# Altium schematic sheet FPGA_165B_StopWatch.SchDoc
size B; Organization: Altium Limited; Address1: L3, 12a Rodborough Rd; Address2: Frenchs Forest; Address3: NSW; Address4: Australia 2086; DocumentNumber: 1; SheetNumber: 1
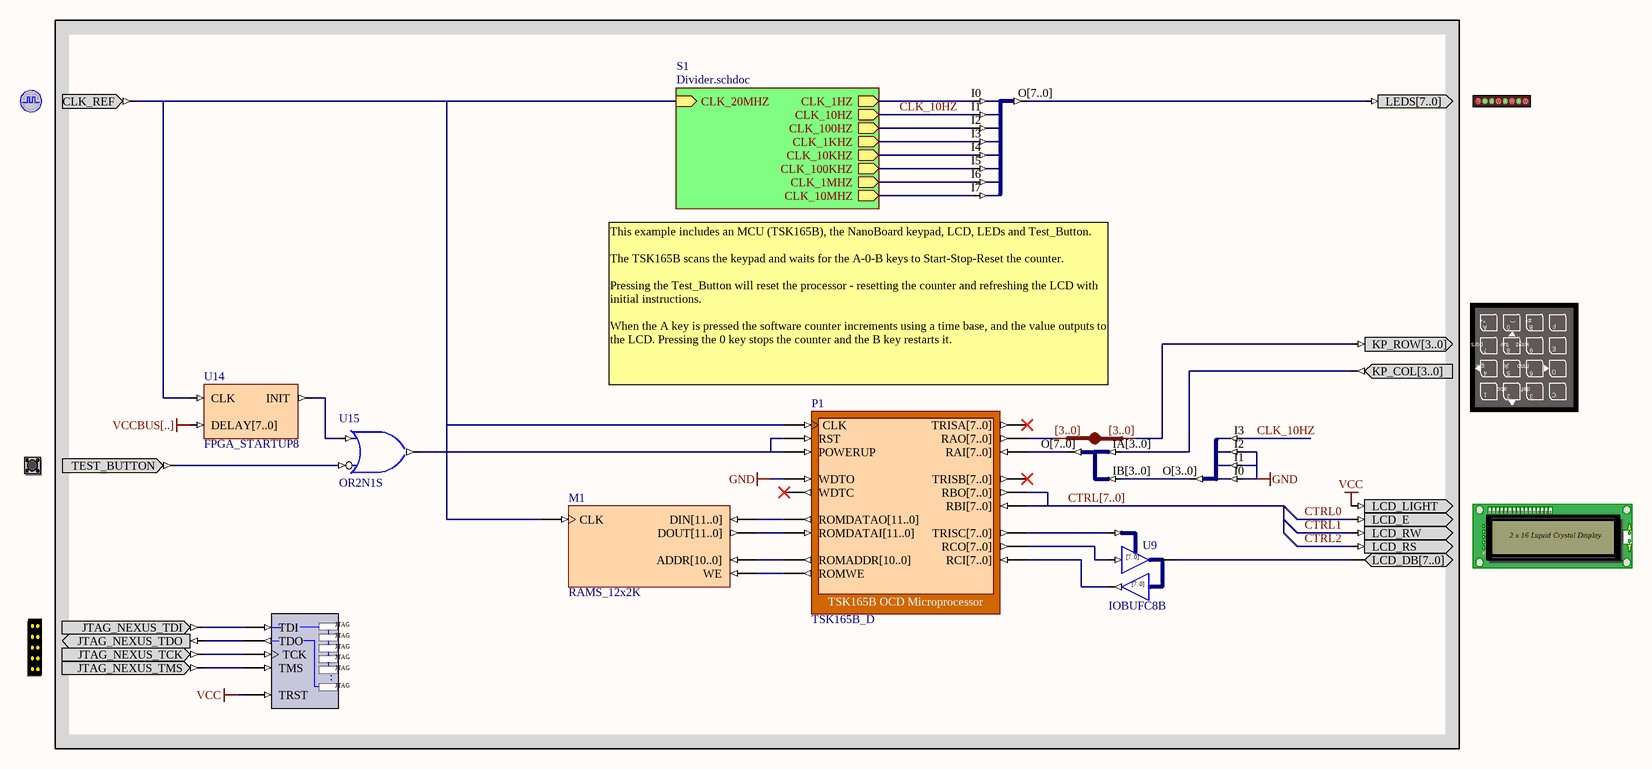
[diagram p0: FPGA_165B_StopWatch.SchDoc]

## Parts
(Parts that share a designator on the sheet are numbered #1, #2 ... from top to bottom, then left to right.)
?#1  LED  (value not drawn)
?#2  CLOCK_REFERENCE  (value not drawn)
?#3  KEYPAD  (value not drawn)
?#4  TEST_BUTTON  (value not drawn)
?#5  LCD  (value not drawn)
?#6  NEXUS_JTAG_CONNECTOR  (value not drawn)
JB_AUTO?  IndexA: [3..0]  (hidden comment: JB)
M1  RAMS_12x2K
NEXUS_JTAG_PORT  NEXUS_JTAG_PORT  (value not drawn)
P1  TSK165B_D
U9  IOBUFC8B
U10  J8S_8B  (value not drawn)
U12  J4S_4B  (value not drawn)
U13  J4B2_8B  (value not drawn)
U14  FPGA_STARTUP8
U15  OR2N1S

## Sub-sheets
S1 = Divider.schdoc: CLK_20MHZ (in), CLK_10HZ (out), CLK_100HZ (out), CLK_1KHZ (out), CLK_10KHZ (out), CLK_100KHZ (out), CLK_1MHZ (out), CLK_10MHZ (out), CLK_1HZ (out)

## Nets
GND: P1.WDTO U12.I0 U12.I1 U12.I2
VCC: ?#5.LCD_LIGHT NEXUS_JTAG_PORT.TRST
VCCBUS[..]: U14.DELAY[7..0]
CLK_10HZ: U10.I1 U12.I3 ; sheet S1/CLK_10HZ
CTRL0: ?#5.LCD_E
CTRL1: ?#5.LCD_RW
CTRL2: ?#5.LCD_RS
CTRL[7..0]: P1.RBI[7..0] P1.RBO[7..0]
Net?#1_LEDS[7..0]: ?#1.LEDS[7..0] U10.O[7..0]
Net?#2_CLK_REF: ?#2.CLK_REF M1.CLK P1.CLK U14.CLK ; sheet S1/CLK_20MHZ
Net?#3_KP_COL[3..0]: ?#3.KP_COL[3..0] U13.IA[3..0]
Net?#3_KP_ROW[3..0]: ?#3.KP_ROW[3..0] JB_AUTO?.B[0..0]
Net?#4_TEST_BUTTON: ?#4.TEST_BUTTON U15.I0
Net?#5_LCD_DB[7..0]: ?#5.LCD_DB[7..0] U9.IO[7..0]
Net?#6_JTAG_NEXUS_TCK: ?#6.JTAG_NEXUS_TCK NEXUS_JTAG_PORT.TCK
Net?#6_JTAG_NEXUS_TDI: ?#6.JTAG_NEXUS_TDI NEXUS_JTAG_PORT.TDI
Net?#6_JTAG_NEXUS_TDO: ?#6.JTAG_NEXUS_TDO NEXUS_JTAG_PORT.TDO
Net?#6_JTAG_NEXUS_TMS: ?#6.JTAG_NEXUS_TMS NEXUS_JTAG_PORT.TMS
NetJB_AUTO?_A[0..0]: JB_AUTO?.A[0..0] P1.RAO[7..0]
NetM1_ADDR[10..0]: M1.ADDR[10..0] P1.ROMADDR[10..0]
NetM1_DIN[11..0]: M1.DIN[11..0] P1.ROMDATAO[11..0]
NetM1_DOUT[11..0]: M1.DOUT[11..0] P1.ROMDATAI[11..0]
NetM1_WE: M1.WE P1.ROMWE
NetP1_POWERUP: P1.POWERUP P1.RST U15.O
NetP1_RAI[7..0]: P1.RAI[7..0] U13.O[7..0]
NetP1_RCI[7..0]: P1.RCI[7..0] U9.O[7..0]
NetP1_RCO[7..0]: P1.RCO[7..0] U9.I[7..0]
NetP1_TRISC[7..0]: P1.TRISC[7..0] U9.T[7..0]
NetU10_I0: U10.I0 ; sheet S1/CLK_1HZ
NetU10_I2: U10.I2 ; sheet S1/CLK_100HZ
NetU10_I3: U10.I3 ; sheet S1/CLK_1KHZ
NetU10_I4: U10.I4 ; sheet S1/CLK_10KHZ
NetU10_I5: U10.I5 ; sheet S1/CLK_100KHZ
NetU10_I6: U10.I6 ; sheet S1/CLK_1MHZ
NetU10_I7: U10.I7 ; sheet S1/CLK_10MHZ
NetU12_O[3..0]: U12.O[3..0] U13.IB[3..0]
NetU14_INIT: U14.INIT U15.I1

Not connected (* = marked no-connect by the designer): P1 TRISA[7..0]* TRISB[7..0]* WDTC*

## Buses and harness runs
bus CTRL[7..0]

## Notes on the sheet
- This example includes an MCU (TSK165B), the NanoBoard keypad, LCD, LEDs and Test_Button.
  The TSK165B scans the keypad and waits for the A-0-B keys to Start-Stop-Reset the counter.
  Pressing the Test_Button will reset the processor - resetting the counter and refreshing the LCD with initial instructions.
  When the A key is pressed the software counter increments using a time base, and the value outputs to the LCD. Pressing the 0 key stops the counter and the B key restarts it.
- Title
- Size:
- Date:
- B
- Number:
- Time:
- Revision:
- Sheet
- of
- File:
- (in symbol IOBUFC8B) [7..0]
- (in symbol KEYPAD) *+; (; #^; A; 0; B; F; pqrs; tuv; wxyz; 7; 8; 9; E; ghi; jkl; mno; D; 4; 5; 6; abc; def; 1; 2; 3; C
- (in symbol LCD) 2 x 16 Liquid Crystal Display
- (in symbol NEXUS_JTAG_PORT) JTAG; .

## Library data of the parts
?#1 = LED: 8-Way LEDS; PortComponent: True; Published: 19-Nov-2003; Publisher: Altium Limited
?#2 = CLOCK_REFERENCE: Global System Clock Reference Supply; PortComponent: True; Published: 19-Nov-2003; Publisher: Altium Limited
?#3 = KEYPAD: Key Pad; PortComponent: True; Published: 19-Nov-2003; Publisher: Altium Limited
?#4 = TEST_BUTTON: Test Button; PortComponent: True; Published: 19-Nov-2003; Publisher: Altium Limited
?#5 = LCD: Liquid Crystal Display; PortComponent: True; Published: 19-Nov-2003; Publisher: Altium Limited
?#6 = NEXUS_JTAG_CONNECTOR: JTAG Port; PortComponent: True; Published: 19-Nov-2003; Publisher: Altium Limited
JB_AUTO? = JB: System BUS Joiner; ArchiveName: GENERIC; Published: 18-Dec-2003; Publisher: Altium Limited; Core Revision: 1.00.00; IndexB: [3..0]
M1 = RAMS_12x2K: Single Port Random Access Memory; Memory_Depth: 2048; Memory_Type: RAM_SinglePortBlock; Memory_Width: 12; Memory_ClockEdge: Rising; Nexus_Core: Memory_Program; Published: 13/01/2004; Publisher: Altium Hobart Technology Center
NEXUS_JTAG_PORT = NEXUS_JTAG_PORT: Soft Nexus-Chain Connector; NEXUS_JTAG_CONNECTOR: True; Published: 18-Dec-2003; Publisher: Altium Limited
P1 = TSK165B_D: TSK165B OCD Microprocessor; NEXUS_CORE: Processor_OCDS; NEXUS_JTAG_DEVICE: True; NEXUS_JTAG_ORDER: 0; ChildModel1: TSK165B_D_RAM128x8; ChildCore1: M1; Published: 1/12/2003; Publisher: Altium Hobart Technology Centre; Core Revision: 1.00.00
U9 = IOBUFC8B: 8-Bit Input/Output Buffer With Separated Control, Bus Version; ArchiveName: GENERIC; Published: 18-Nov-2003; Publisher: Altium Limited; Core Revision: 1.00.00
U10 = J8S_8B: 8 Single pin inputs to single 8-Bit output bus; ArchiveName: GENERIC; Published: 18-Nov-2003; Publisher: Altium Limited; Core Revision: 1.00.00
U12 = J4S_4B: 4 Single pin inputs to single 4-Bit output bus; ArchiveName: GENERIC; Published: 18-Dec-2003; Publisher: Altium Limited; Core Revision: 1.00.00
U13 = J4B2_8B: 2 x 4-Bit input bus to 1 x 8-bit output bus; ArchiveName: GENERIC; Published: 18-Dec-2003; Publisher: Altium Limited; Core Revision: 1.00.00
U14 = FPGA_STARTUP8: FPGA Startup With 8 Bit Delay; Published: 21/01/2004; Publisher: Altium Hobart Technology Centre; Core Revision: 1.00.00
U15 = OR2N1S: 2-Input OR Gate with Active Low A Input, Single Pin Version; Xilinx Equivalent: OR2B1; ArchiveName: GENERIC; Published: 18-Dec-2003; Publisher: Altium Limited; Core Revision: 1.00.00